# Altium project ChildPCBRocketV4.PrjPcb
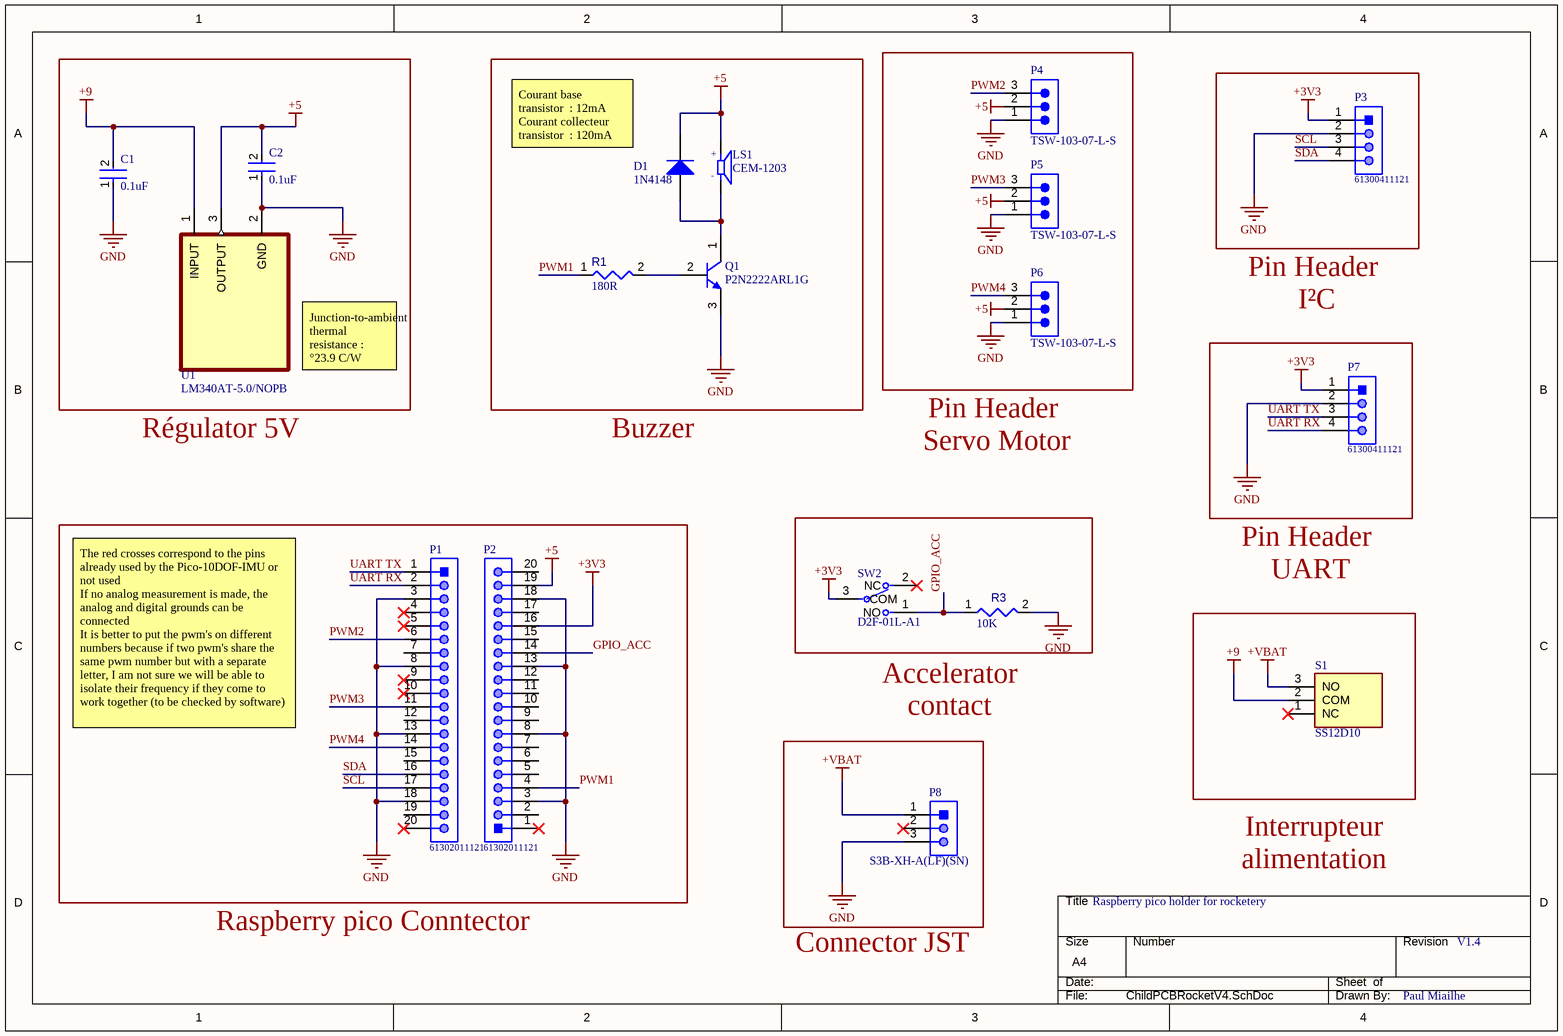
[diagram p0: ChildPCBRocketV4.SchDoc]
1 sheet, 18 parts. Net scope: global (net labels, ports and power ports of the same name join across sheets).
Board file: ChildPCBRocketV4.PcbDoc

## Sheet ChildPCBRocketV4.SchDoc: Raspberry pico holder for rocketery
size A4; Author: Paul Miailhe; CompanyName: Planete Science; DrawnBy: Paul Miailhe; Engineer: Paul Miailhe; Organization: Rocket Occitanie; DocumentNumber: 1; Revision: V1.4; SheetNumber: 1; SheetTotal: 1

### Parts
C1  0.1uF  [FP-RCE1K1-2_5-MFG]
C2  0.1uF  [FP-RCE1K1-2_5-MFG]
D1  1N4148  [NXP-SOD27-2_V]
LS1  CEM-1203  [CUI_CEM-1203(42)]
P1  61302011121  [61302011121]
P2  61302011121  [61302011121]
P3  61300411121  [61300411121]
P4  TSW-103-07-L-S  [SMTC-TSW-103-07-X-S]
P5  TSW-103-07-L-S  [SMTC-TSW-103-07-X-S]
P6  TSW-103-07-L-S  [SMTC-TSW-103-07-X-S]
P7  61300411121  [61300411121]
P8  S3B-XH-A(LF)(SN)  [JST-S3B-XH-A(LF)(SN)_V]
Q1  P2N2222ARL1G  [ONSC-TO-92-3-29-11_AM_BL]
R1  value 180R  [RESA60-630X240]  (hidden comment: MFR-25FBF52-100R)
R3  value 10K  [RESA60-630X240]  (hidden comment: MFR-25FBF52-100R)
S1  SS12D10  [SS12D10]
SW2  D2F-01L-A1  [FP-D2F-01L-A1-MFG]
U1  LM340AT-5.0/NOPB  [TO254P1054X470X1955-3]

### Nets
+3V3: P2.16 P3.1 P7.1 SW2.3(COM)
+5: C2.2 D1.2(K) LS1.P P2.19 P4.2 P5.2 P6.2 U1.3(OUTPUT)
+9: C1.2 S1.2(COM) U1.1(INPUT)
+VBAT: P8.1 S1.3(NO)
GND: C1.1 C2.1 P1.3 P1.8 P1.13 P1.18 P2.3 P2.8 P2.13 P2.18 P3.2 P4.1 P5.1 P6.1 P7.2 P8.3 Q1.3(E) R3.2 U1.2(GND)
GPIO_ACC: P2.14 R3.1 SW2.1(NO)
PWM1: P2.4 R1.1
PWM2: P1.6 P4.3
PWM3: P1.11 P5.3
PWM4: P1.14 P6.3
SCL: P1.17 P3.3
SDA: P1.16 P3.4
UART RX: P1.2 P7.4
UART TX: P1.1 P7.3
NetD1_1: D1.1(A) LS1.N Q1.1(C)
NetQ1_2: Q1.2(B) R1.2

Not connected (* = marked no-connect by the designer): P1 4* 5* 7 9* 10* 12 15 19 20*; P2 1* 2 5 6 7 9 10 11 12 15 17 20; P8 2*; S1 1(NC)*; SW2 2(NC)*

### Notes on the sheet
- (near D1) Courant base transistor  : 12mA
  Courant collecteur transistor  : 120mA
- Pin Header
  I²C
- Junction-to-ambient thermal resistance : °23.9 C/W
- Régulator 5V
- Buzzer
- Pin Header
  Servo Motor
- Pin Header
  UART
- The red crosses correspond to the pins already used by the Pico-10DOF-IMU or not used
  If no analog measurement is made, the analog and digital grounds can be connected
  It is better to put the pwm's on different numbers because if two pwm's share the same pwm number but with a separate letter, I am not sure we will be able to isolate their frequency if they come to work together (to be checked by software)
- Accelerator contact
- Interrupteur alimentation
- Raspberry pico Conntector
- Connector JST
- DWG NO:
- REV:
- THIS DOCUMENT AND THE DATA DISCLOSED HEREIN OR
- HEREWITH IS THE PROPERTY OF ALTIUM LIMITED AND MAY
- BE FREELY DISTRIBUTED IN WHOLE. NO RIGHTS ARE
- RESERVED OR EXPRESS OR IMPLIED WARANTEE GIVEN.
- REVISION
- DESCRIPTION
- DATE
- APPROVED
- ENG:
- APPROVALS
- PROJECT
- DSN:
- CHK:
- REFERENCE DOCUMENTS
- PROJECT REVISION:
- TITLE
- DOCUMENT REVISION:
- DESIGN ITEM:
- BOM:
- FAB DWG:
- PCB DWG:
- ASSY DWG:
- SCALE:
- A2
- SIZE
- CAGE CODE
- FILE NAME
- DWG NO.
- SHEET
- OF
- REV
- (in symbol CEM-1203(42)) +; -

### Library data of the parts
C1 C2 = CMP-06035-036150-1: Cap Ceramic Monolithic 220nF 50V 10% Thru-Hole Bulk; Lead Diameter: 0.5mm; Lead/Base Style: Formed Leads; Dielectric: X7R; Capacitance: 220nF; Width: 0.098inch; Package Quantity: 1; Mount: Through Hole; Voltage Rating: 50V; Voltage Rating (DC): 50V; Height: 3.5mm; Tolerance: 10%; Height - Seated (Max): 0.138inch; Packaging: Tape and Reel; Termination: Radial; Ratings: AEC-Q200; Resistor Type: Ceramic; Lead Pitch: 0.197inch; Max Operating Temperature: 125°C; Min Operating Temperature: -55°C; Case/Package: Radial; Length: 0.157inch
D1 = CMP-0648-00002-1: High-speed Diode, 100 V, 450 mA, 2-Pin SOD27, RoHS; Manufacturer: NXP Semiconductors; Configuration: Single; IR (VR: 20 V)=25 nA; IFRM: 450 mA; IFSM: 4 A Max.; Trr: 4 ns Max.; Cd: 4 pF Max.; VR: 100 V Max.; VF (IF: 10 mA)=1 V; IF: 200 mA Max.; ComponentLink1Description: Manufacturer URL; RoHS: TRUE; ComponentLink1URL: http://www.nxp.com/; ComponentLink3Description: Package Specification; DatasheetVersion: Aug-04; ComponentLink2Description: Datasheet; PackageVersion: Aug-04; PackageReference: SOD27; ComponentLink3URL: http://www.nxp.com/documents/data_sheet/1N4148_1N4448.pdf; Mounting Technology: Through Hole; ComponentLink2URL: http://www.nxp.com/documents/data_sheet/1N4148_1N4448.pdf; PartNumber: 1N4148; PackageDescription: 2-Pin Hermetically Sealed Glass Package, Axial Leaded, Dia 1.85 mm, Body Length 4.25 mm, Lead Spread 25.4 mm
LS1 = CEM-1203(42): 12 mm, 3.5 V, 85 dB, Through Hole, Magnetic Audio Transducer Buzzer; MF: {'manufacturer': u'CUI Devices'}; Package: None; MP: CEM-1203(42); Price: None; Value: *; Availability: Unavailable
P1 P2 = CMP-1502-01102-1: THT Vertical Pin Header WR-PHD, Pitch 2.54 mm, Single Row, 20 pins; Manufacturer: Wurth Elektronik; Withstanding Voltage: 500VAC; Gender: Male; Pin Number: 20; Rated Current: 3A; Contact Resistance: 20mOhm; Pitch: 2.54mm; Working Voltage: 250VAC; Publisher: WurthElektronik; Packaging: Bag; Datasheet URL: https://katalog.we-online.de/em/datasheet/6130xx11121.pdf; Row Number: Single; Mounting Technology: THT; Manufacturer URL: http://www.we-online.de; Orientation: Vertical; Package Reference: 61302011121; Part Number: 61302011121; Operating Temperature: -40to105degC
P3 P7 = CMP-1502-01064-1: THT Vertical Pin Header WR-PHD, Pitch 2.54 mm, Single Row, 4 pins; Manufacturer: Wurth Elektronik; Withstanding Voltage: 500VAC; Rated Current: 3A; Working Voltage: 250VAC; Pin Number: 4; Gender: Male; Contact Resistance: 20mOhm; Pitch: 2.54mm; Manufacturer URL: http://www.we-online.de; Operating Temperature: -40to105degC; Packaging: Bag; Mounting Technology: THT; Package Reference: 61300411121; Datasheet URL: https://katalog.we-online.de/em/datasheet/6130xx11121.pdf; Publisher: WurthElektronik; Part Number: 61300411121; Row Number: Single; Orientation: Vertical
P4-P6 = CMP-1024-00334-1: 0.025" SQ Post Header, Through-hole, Vertical, -55 to 125 degC, 2.54 mm Pitch, 3-Pin, Male, RoHS; Manufacturer: Samtec; Pitch: 2.54 mm; Mounting Technology: Through-hole; ComponentLink2URL: http://www.samtec.com/documents/webfiles/pdf/TSW_TH.PDF; ComponentLink3Description: Package Specification; PackageVersion: DM, 8/1988; PartNumber: TSW-103-07-L-S; PackageReference: TSW-103-07-X-S; Orientation: Vertical; ComponentLink1URL: http://www.samtec.com; PackageDescription: .025[0.64] SQ. Post Terminal Strip Assembly; ComponentLink1Description: Manufacturer URL; ComponentLink2Description: Datasheet; ComponentLink3URL: http://www.samtec.com/documents/webfiles/cpdf/TSW-XXX-XX-XXX-X-XX-XXX-MKT.pdf; RoHS: True; DatasheetVersion: F-214; Temperature Range: -55 to 125 degC
P8 = CMP-1755-00006-1: Male Header, Pitch 2.5 mm, 1 x 3 Position, Height 6.1 mm, Tail Length 3.4 mm, -25 to 85 degC, RoHS, Bulk; Min Supply Voltage: 1 V; Frequency: 1.8 MHz; Channels: 1; Nominal Supply Current: 170 uA; Max Power Dissipation: 1 W; Max Ouput Current: -10 mA; Case\Package: DIP; Max Supply Voltage: 15 V; Min Operating Temperature: 0 degC; Weight: 0.015535 oz; Radiation Hardening: No; ComponentLink1URL: http://www.jst.com/home2.html; PackageReference: S3B-XH-A(LF)(SN); Length: 9.81 mm; Max Operating Temperature: 70 degC; Package Quantity: 50; REACH SVHC: No SVHC; Mount: Through Hole; Pins: 8; Height: 4.57 mm; DatasheetVersion: May-16; ComponentLink1Description: Manufacturer URL; PackageDescription: Male Header, Pitch 2.5 mm, 1 x 3 Position, Height 6.1 mm, Tail Length 3.4 mm; RoHSCompliant: true; Packaging: Rail/Tube; Width: 6.35 mm; ComponentLink2URL: http://www.jst-mfg.com/product/pdf/eng/eXH.pdf; ComponentLink2Description: Datasheet
Q1 = CMP-1048-01587-1: Amplifier Transistor, NPN Silicon, 3-Pin TO-92, Pb-Free, Tape and Reel; Manufacturer: On Semiconductor; IC Continuous (A): 0.6; fT Min (MHz): 300; PackageDescription: 3-Pin Transistor Outline, Body 4.825 x 3.685 mm, Pitch 1.27 mm; PackageReference: TO-92-3-29-11_AM_BL; DatasheetVersion: Rev. 7; ComponentLink2Description: Datasheet; RoHS: TRUE; ComponentLink1Description: Manufacturer URL; ComponentLink1URL: http://www.onsemi.com/; PackageVersion: Rev. AM; Polarity: NPN; ComponentLink3Description: Package Specification; PartNumber: P2N2222ARL1G; ComponentLink3URL: http://www.onsemi.com/pub_link/Collateral/MAC97-D.PDF; Mounting Technology: Through Hole; ComponentLink2URL: http://www.onsemi.com/pub_link/Collateral/P2N2222A-D.PDF; Packing: Tape and Reel
R1 R3 = CMP-009-00046-4: Axial Resistor, 100 Ohm, +/- 1%, 0.25 W, -55 to 155 degC, 2-Pin THD, RoHS, Bulk; Manufacturer: Yageo; Voltage Rating: 250V; Power: 250mW; Packaging: Bulk; Max Operating Temperature: 155°C; Mounting Technology: TH; Datasheet Version: Apr-13; Case/Package: Axial; RoHS Compliant: True; Package Description: 2-Pin Axial Lead, Dia 2.4 mm, Body Length 6.3 mm; Package Quantity: 200; Package Reference: MFR-25; Tolerance: 1%; Composition: CarbonFilm; Datasheet URL: http://www.yageo.com/documents/recent/Yageo%20LR_MFR_2013.pdf; Manufacturer URL: http://www.yageo.com/; Min Operating Temperature: -55°C
S1 = SS12D10: Switch; Manufacturer_Name: DAIER; Datasheet Link: https://www.chinadaier.com/slide-switch-spdt/; Height: 9.91mm; Manufacturer_Part_Number: SS12D10
SW2 = CMP-08833-000018-1: SWITCH SNAP ACT SPDT 100MA 30V; Electrical Life: 30000Cycles; Ratings: IP40; Overtravel: 0.022inch; Differential Travel: 0.02inch; Mechanical Life: 1000000Cycles; Operating Force: 0.78N; Operating Position: 0.268inch; Switch Function: On-Mom; Current Rating: 100mA; Package Quantity: 450; Voltage Rating (DC): 30V; Max Voltage Rating (DC): 30V; Max Operating Temperature: 65°C; Orientation: Right Angle; Contact Material: Gold; Radiation Hardening: No; RoHS Compliant: Yes; Packaging: Bulk; Min Operating Temperature: -25°C; Mount: Through Hole; Throw Configuration: SPDT; Series: D2F; Termination: PC Pin
U1 = LM340AT-5.0/NOPB: MF: {'manufacturer': u'Texas Instruments'}; Package: None; MP: LM340AT-5.0/NOPB; Price: None; Value: *; Availability: Unavailable